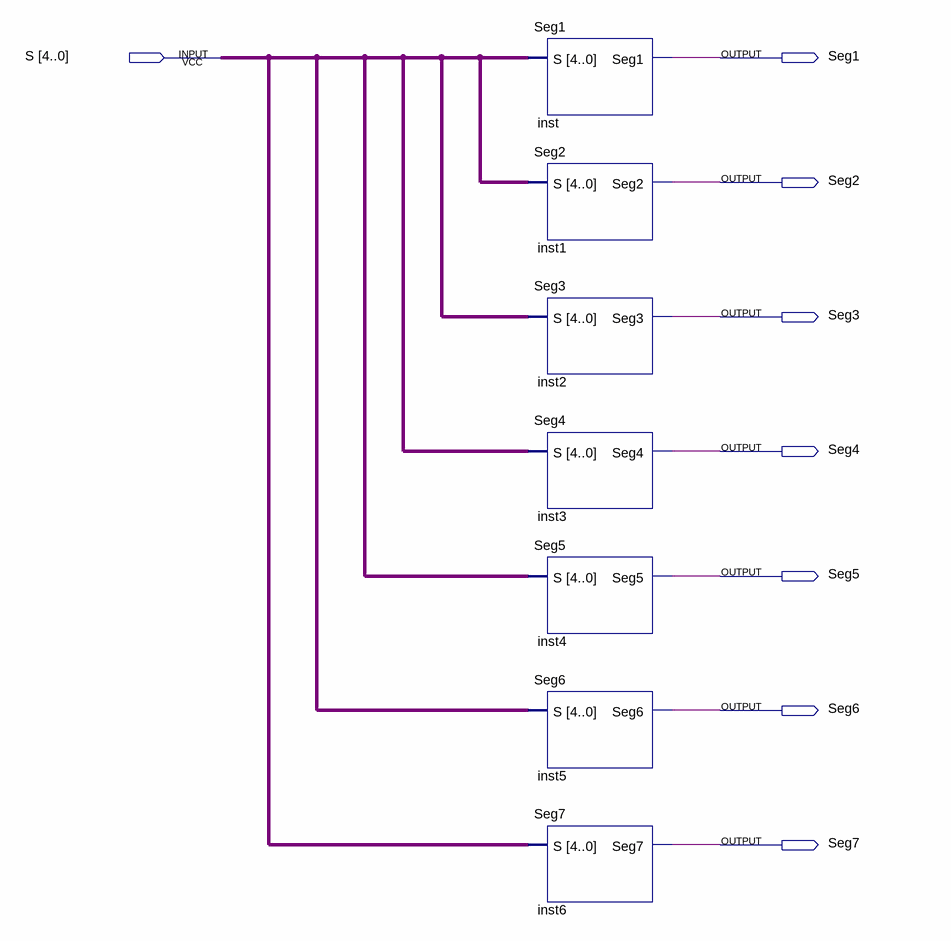
[diagram p0: schematic sheet]
// Quartus schematic Teste_1_Display.bdf as structural Verilog: 7 symbols, 8 pins
module Teste_1_Display (
  input  [4:0] S,
  output Seg1,
  output Seg2,
  output Seg3,
  output Seg4,
  output Seg5,
  output Seg6,
  output Seg7
);

  Seg1 inst (.S(S), .Seg1(Seg1));
  Seg2 inst1 (.S(S), .Seg2(Seg2));
  Seg3 inst2 (.S(S), .Seg3(Seg3));
  Seg4 inst3 (.S(S), .Seg4(Seg4));
  Seg5 inst4 (.S(S), .Seg5(Seg5));
  Seg6 inst5 (.S(S), .Seg6(Seg6));
  Seg7 inst6 (.S(S), .Seg7(Seg7));
endmodule
